# Altium schematic sheet Pre-Discharge.SchDoc
size A4
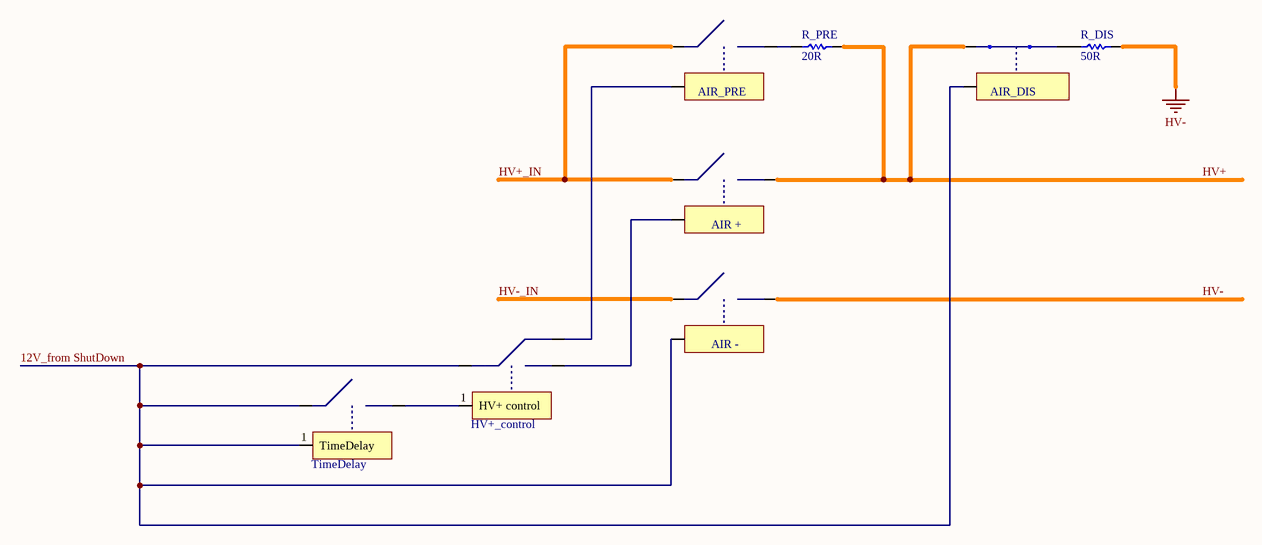
[diagram p0: Pre-Discharge.SchDoc]

## Parts
AIR_+  AIR +  (value not drawn)
AIR_-  AIR -  (value not drawn)
AIR_DIS  AIR N/C  (value not drawn)
AIR_PRE  AIR  (value not drawn)
HV+_Relay  HV+_control
R_DIS  50R
R_PRE  20R
TimeDelayRelay  TimeDelay

## Nets
HV-: AIR_-.3 R_DIS.2
12V_from ShutDown: AIR_-.1 AIR_DIS.1 HV+_Relay.2 TimeDelayRelay.1(TimeDelay) TimeDelayRelay.2
HV+: AIR_+.3 AIR_DIS.2 R_PRE.2
HV+_IN: AIR_+.2 AIR_PRE.2
HV-_IN: AIR_-.2
NetAIR_+_1: AIR_+.1 HV+_Relay.3
NetAIR_DIS_3: AIR_DIS.3 R_DIS.1
NetAIR_PRE_1: AIR_PRE.1 HV+_Relay.3
NetAIR_PRE_3: AIR_PRE.3 R_PRE.1
NetHV+_Relay_1: HV+_Relay.1(HV+_control) TimeDelayRelay.3

## Library data of the parts
AIR_+ AIR_- = AIR
HV+_Relay = SPDT_Relay
R_DIS R_PRE = Res